# Altium schematic sheet nusense-power-decoupling.schdoc: NUSense
size A4; Organization: Elby Designs; Address1: 9 Follan Close; Address2: Kariong; Address3: NSW 2250; Address4: Australia; Revision: 1; SheetNumber: 9; SheetTotal: 9; DrawnBy: Power Supply Decoupling; Engineer: Laurie Biddulph; PageSetup: Record=PageOptions|CenterHorizontal=True|CenterVertical=True|PrintScale=1.38|XCorrection=1.00|YCorrection=1.00|PrintKind=1|BorderSize=5000000|LeftOffset=0|BottomOffset=0|Orientation=2|PaperLength=1000|PaperWidth=1000|Scale=100|PaperSource=7|PrintQuality=-4|MediaType=1|DitherType=10|PaperKind=A3|PrintScaleMode=1
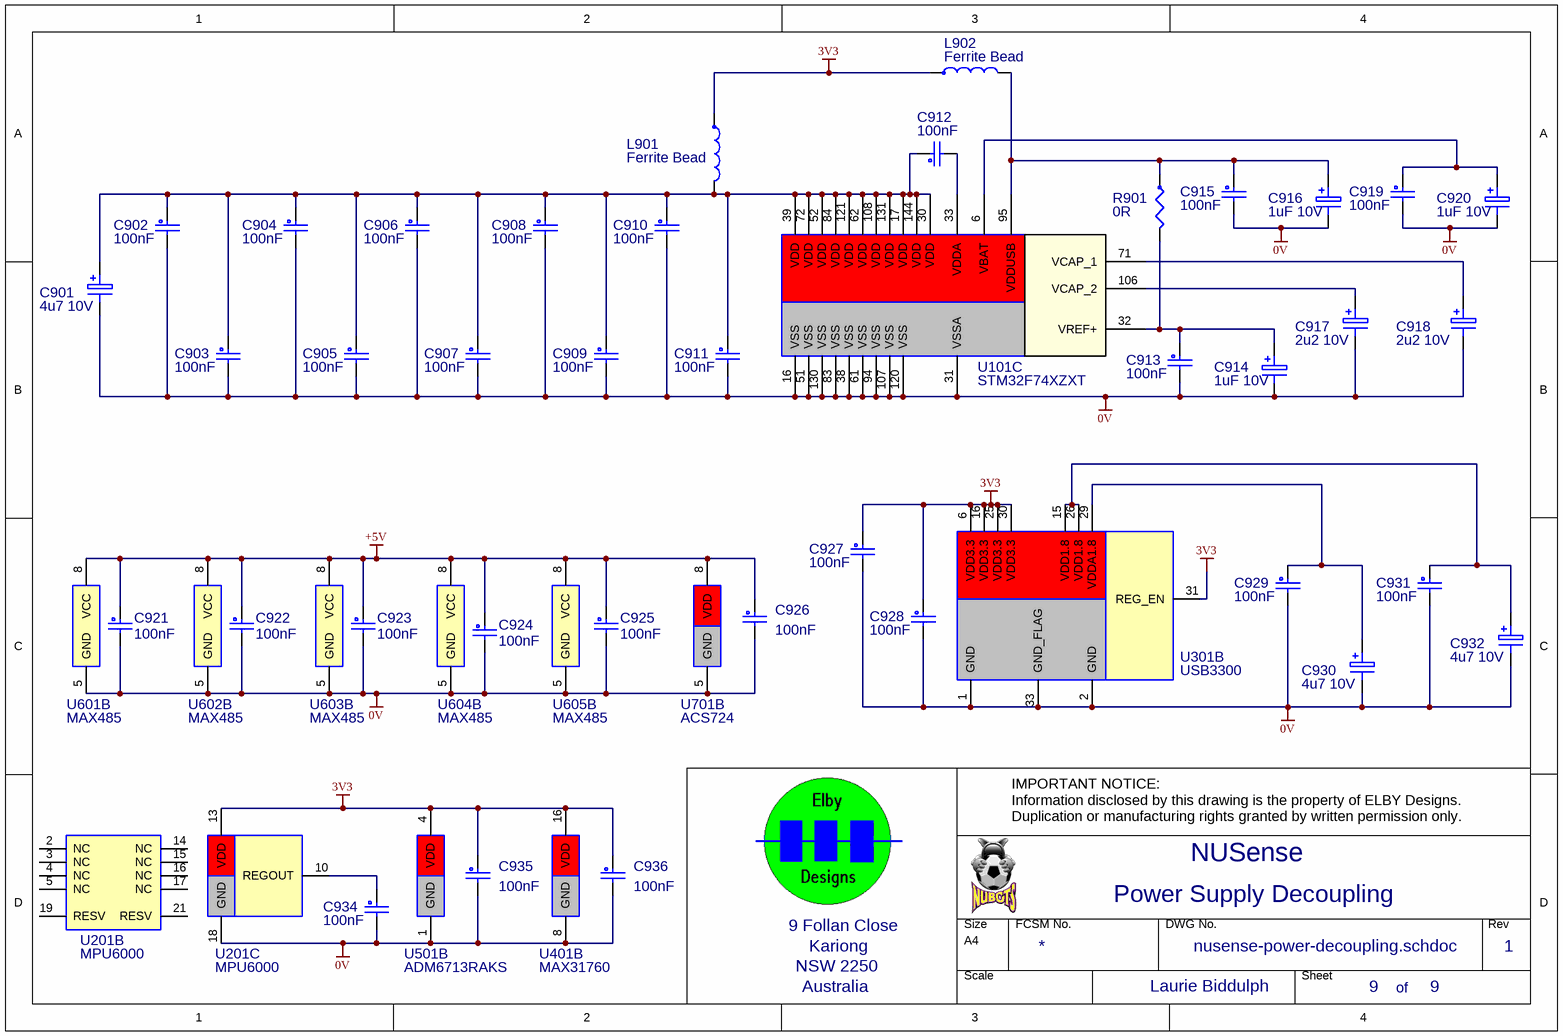
[diagram p0: nusense-power-decoupling.schdoc]

## Parts
C901  4u7 10V  [RB-D5.0-P2.0]
C902  100nF  [RAD-0.2N(LB)]
C903  100nF  [RAD-0.2N(LB)]
C904  100nF  [RAD-0.2N(LB)]
C905  100nF  [RAD-0.2N(LB)]
C906  100nF  [RAD-0.2N(LB)]
C907  100nF  [RAD-0.2N(LB)]
C908  100nF  [RAD-0.2N(LB)]
C909  100nF  [RAD-0.2N(LB)]
C910  100nF  [RAD-0.2N(LB)]
C911  100nF  [RAD-0.2N(LB)]
C912  100nF  [RAD-0.2N(LB)]
C913  100nF  [RAD-0.2N(LB)]
C914  1uF 10V  [RB-D5.0-P2.0]
C915  100nF  [RAD-0.2N(LB)]
C916  1uF 10V  [RB-D5.0-P2.0]
C917  2u2 10V  [RB-D5.0-P2.0]
C918  2u2 10V  [RB-D5.0-P2.0]
C919  100nF  [RAD-0.2N(LB)]
C920  1uF 10V  [RB-D5.0-P2.0]
C921  100nF  [RAD-0.2N(LB)]
C922  100nF  [RAD-0.2N(LB)]
C923  100nF  [RAD-0.2N(LB)]
C924  100nF  [RAD-0.2N(LB)]
C925  100nF  [RAD-0.2N(LB)]
C926  100nF  [RAD-0.2N(LB)]
C927  100nF  [RAD-0.2N(LB)]
C928  100nF  [RAD-0.2N(LB)]
C929  100nF  [RAD-0.2N(LB)]
C930  4u7 10V  [RB-D5.0-P2.0]
C931  100nF  [RAD-0.2N(LB)]
C932  4u7 10V  [RB-D5.0-P2.0]
C934  100nF  [RAD-0.2N(LB)]
C935  100nF  [RAD-0.2N(LB)]
C936  100nF  [RAD-0.2N(LB)]
L901  Ferrite Bead  [AXIAL-0.3IND(LB)]
L902  Ferrite Bead  [AXIAL-0.3IND(LB)]
R901  0R  [AXIAL-0.4(LB)]
U101  STM32F74XZXT  [LQFP-144_20X20mm]  (part C of 3)
U201  MPU6000  (parts B,C of 3)
U301  USB3300  [QFN-32_L]  (part B of 2)
U401  MAX31760  (part B of 2)
U501  ADM6713RAKS  (part B of 2)
U601  MAX485  [DIP-8(LB)]  (part B of 2)
U602  MAX485  [DIP-8(LB)]  (part B of 2)
U603  MAX485  [DIP-8(LB)]  (part B of 2)
U604  MAX485  [DIP-8(LB)]  (part B of 2)
U605  MAX485  [DIP-8(LB)]  (part B of 2)
U701  ACS724  (part B of 2)

## Nets
0V: C901.2 C902.2 C903.2 C904.2 C905.2 C906.2 C907.2 C908.2 C909.2 C910.2 C911.2 C913.2 C914.2 C915.2 C916.2 C917.2 C918.2 C919.2 C920.2 C921.2 C922.2 C923.2 C924.2 C925.2 C926.2 C927.2 C928.2 C929.2 C930.2 C931.2 C932.2 C934.2 C935.2 C936.2 U101.16(VSS) U101.31(VSSA) U101.38(VSS) U101.51(VSS) U101.61(VSS) U101.83(VSS) U101.94(VSS) U101.107(VSS) U101.120(VSS) U101.130(VSS) U201.18(GND) U301.1(GND) U301.2(GND) U301.33(GND_FLAG) U401.8(GND) U501.1(GND) U601.5(GND) U602.5(GND) U603.5(GND) U604.5(GND) U605.5(GND) U701.5(GND)
3V3: C927.1 C928.1 C935.1 C936.1 L901.1 L902.1 U201.13(VDD) U301.6(VDD3.3) U301.16(VDD3.3) U301.25(VDD3.3) U301.30(VDD3.3) U301.31(REG_EN) U401.16(VDD) U501.4(VDD)
+5V: C921.1 C922.1 C923.1 C924.1 C925.1 C926.1 U601.8(VCC) U602.8(VCC) U603.8(VCC) U604.8(VCC) U605.8(VCC) U701.8(VDD)
NetC901_1: C901.1 C902.1 C903.1 C904.1 C905.1 C906.1 C907.1 C908.1 C909.1 C910.1 C911.1 C912.1 L901.2 U101.17(VDD) U101.30(VDD) U101.39(VDD) U101.52(VDD) U101.62(VDD) U101.72(VDD) U101.84(VDD) U101.108(VDD) U101.121(VDD) U101.131(VDD) U101.144(VDD)
NetC912_2: C912.2 U101.33(VDDA)
NetC913_1: C913.1 C914.1 R901.2 U101.32(VREF+)
NetC915_1: C915.1 C916.1 L902.2 R901.1 U101.95(VDDUSB)
NetC917_1: C917.1 U101.106(VCAP_2)
NetC918_1: C918.1 U101.71(VCAP_1)
NetC919_1: C919.1 C920.1 U101.6(VBAT)
NetC929_1: C929.1 C930.1 U301.29(VDDA1.8)
NetC931_1: C931.1 C932.1 U301.15(VDD1.8) U301.26(VDD1.8)
NetC934_1: C934.1 U201.10(REGOUT)

Not connected (* = marked no-connect by the designer): U201 2(NC) 3(NC) 4(NC) 5(NC) 14(NC) 15(NC) 16(NC) 17(NC) 19(RESV) 21(RESV)

## Notes on the sheet
- IMPORTANT NOTICE:
  Information disclosed by this drawing is the property of ELBY Designs.
  Duplication or manufacturing rights granted by written permission only.
- of

## Library data of the parts
C901 C930 C932 = CE-4U7F50V(LB): 20% 50V Aluminium Electrolytic; EMRP: CE-4U7F
C902-C913 C915 C919 C921-C929 C931 C934-C936 = CC-100NF(LB): Monolithic Ceramic; EMRP: CC-100NF
C914 C916 C920 = CE-1UF50V(LB): 20% 50V Aluminium Electrolytic; EMRP: CE-1UF
C917 C918 = CE-2U2F50V(LB): 20% 50V Aluminium Electrolytic; EMRP: CE-2U2F
L901 L902 = FERRITE-BEAD(LB): EMRP: IN-BEAD
R901 = RM-SC(LB): Resistor - Short Circuit; EMRP: NA
U101 = STM32F74XZXT: 32-bit Microcontroller; Vendor: STMicroelectronics; C: Copyright (C) 2016 Accelerated Designs. All rights reserved; Manufacturer_Part_Number: stm32f74xzxt; Copyright: Copyright (C) 2016 Accelerated Designs. All rights reserved; Value: Value; Type: Type; RefDes: RefDes
U201 = MPU6000: Motion Tracking
U301 = USB3300: USB Host Controller
U401 = MAX31760: Precision Fan Speed
U501 = ADM6713
U601-U605 = MAX485(LB): Low-power, Slew-rate limited RS485/RS422 Transceiver; EMRP: SI-1-MAX485
U701 = ACS724: Current Monitor